# EAGLE schematic GrblMainboard - v3.0 (EAGLE 6.3)
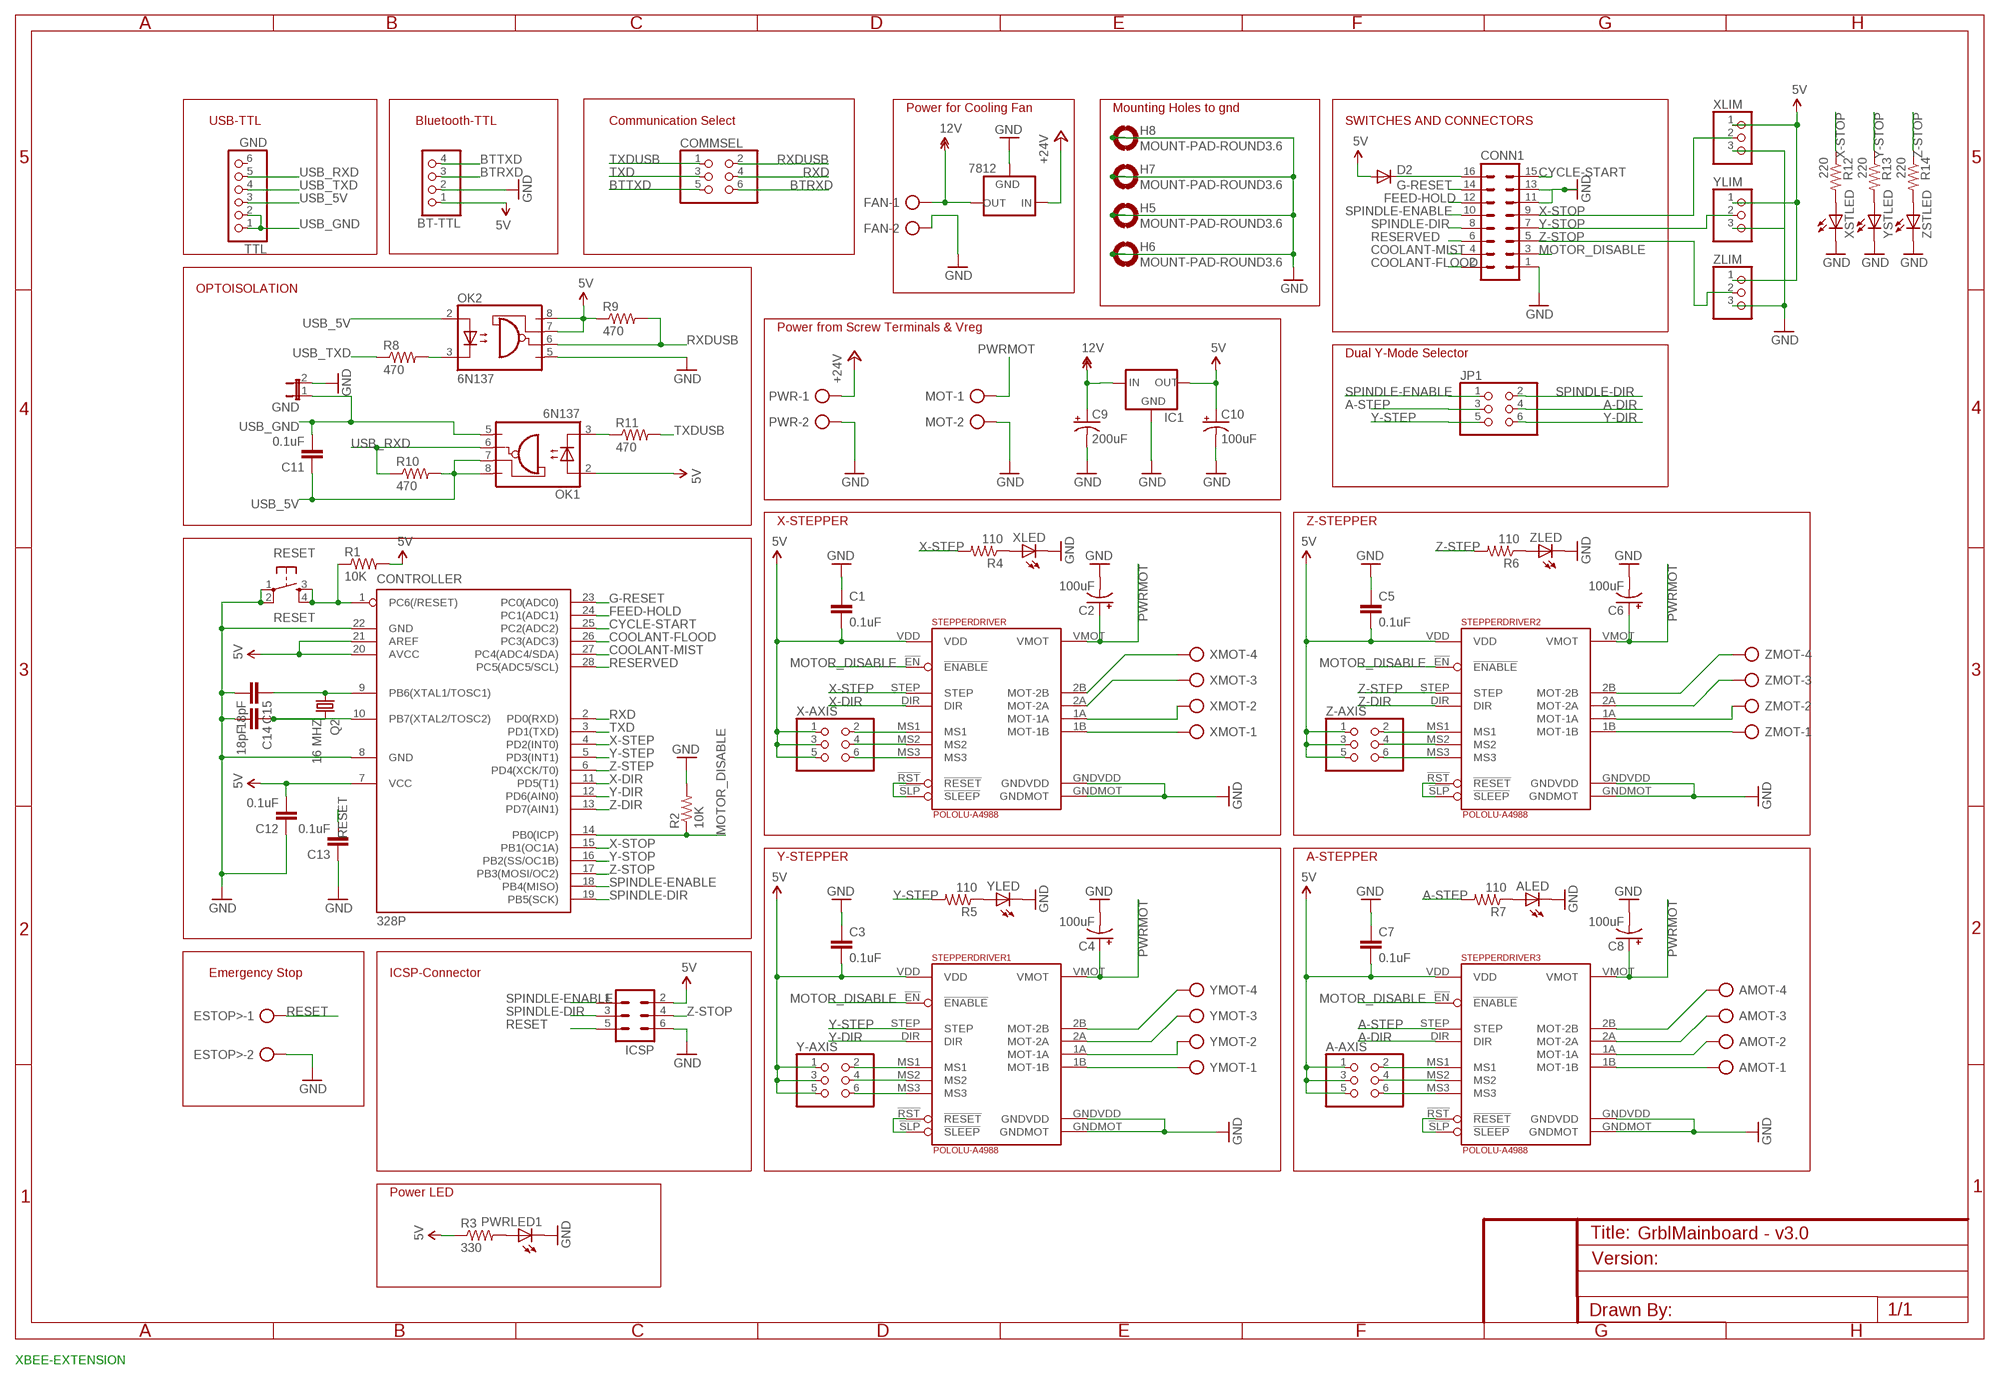
[diagram p0: schematic, sheet 1]

## Parts
328P  CONTROLLER  MEGA8-P  [DIL28-3]
7812  V_REG_78XXSINK  [TO220-IGO]
A-AXIS  PINHD-2X3  [2X03]
ALED  LED3MM  [LED3MM]
AMOT  AK500/4  [AK500/4]
BT-TTL  PINHD-1X4  [1X04]
C1  0.1uF  C-EU025-025X050  [C025-025X050]
C2  100uF  CPOL-USE3.5-8  [E3,5-8]
C3  0.1uF  C-EU025-025X050  [C025-025X050]
C4  100uF  CPOL-USE3.5-8  [E3,5-8]
C5  0.1uF  C-EU025-025X050  [C025-025X050]
C6  100uF  CPOL-USE3.5-8  [E3,5-8]
C7  0.1uF  C-EU025-025X050  [C025-025X050]
C8  100uF  CPOL-USE3.5-8  [E3,5-8]
C9  200uF  CPOL-USE2.5-6  [E2,5-6]
C10  100uF  CPOL-USE2.5-6  [E2,5-6]
C11  0.1uF  C-EU025-025X050  [C025-025X050]
C12  0.1uF  C-EU025-025X050  [C025-025X050]
C13  0.1uF  C-EU025-025X050  [C025-025X050]
C14  18pF  C-EU025-025X050  [C025-025X050]
C15  18pF  C-EU025-025X050  [C025-025X050]
COMMSEL  PINHD-2X3  [2X03]
CONN1  ML16  [ML16]
D2  DIODEPTH  [DIODE-1N4001]
ESTOP>  AK500/2  [AK500/2]
FAN  AK500/2  [AK500/2]
GND  JP1E  [JP1]
H5  MOUNT-PAD-ROUND3.6  [3,6-PAD]
H6  MOUNT-PAD-ROUND3.6  [3,6-PAD]
H7  MOUNT-PAD-ROUND3.6  [3,6-PAD]
H8  MOUNT-PAD-ROUND3.6  [3,6-PAD]
IC1  V_REG_78XXSINK  [TO220-IGO]
ICSP  ML6  [ML6]
JP1  PINHD-2X3  [2X03]
MOT  AK500/2  [AK500/2]
OK1  6N137  [DIL08]
OK2  6N137  [DIL08]
PWR  AK500/2  [AK500/2]
PWRLED1  LED3MM  [LED3MM]
Q2  16 MHZ  CRYSTALHC49S  [HC49/S]
R1  10K  RESISTORAXIAL-0.3  [AXIAL-0.3]
R2  10K  RESISTORAXIAL-0.3  [AXIAL-0.3]
R3  330  RESISTORPTH-1/6W  [1/6W-RES]
R4  110  RESISTORAXIAL-0.3  [AXIAL-0.3]
R5  110  RESISTORAXIAL-0.3  [AXIAL-0.3]
R6  110  RESISTORAXIAL-0.3  [AXIAL-0.3]
R7  110  RESISTORAXIAL-0.3  [AXIAL-0.3]
R8  470  RESISTORAXIAL-0.3  [AXIAL-0.3]
R9  470  RESISTORAXIAL-0.3  [AXIAL-0.3]
R10  470  RESISTORAXIAL-0.3  [AXIAL-0.3]
R11  470  RESISTORAXIAL-0.3  [AXIAL-0.3]
R12  220  RESISTORAXIAL-0.3  [AXIAL-0.3]
R13  220  RESISTORAXIAL-0.3  [AXIAL-0.3]
R14  220  RESISTORAXIAL-0.3  [AXIAL-0.3]
RESET  RESET  TAC_SWITCHPTH  [TACTILE-PTH]
STEPPERDRIVER  POLOLU-A4988  POLOLU-ALLEGRO  [POLOLU-ALLEGRO-PTH]
STEPPERDRIVER1  POLOLU-A4988  POLOLU-ALLEGRO  [POLOLU-ALLEGRO-PTH]
STEPPERDRIVER2  POLOLU-A4988  POLOLU-ALLEGRO  [POLOLU-ALLEGRO-PTH]
STEPPERDRIVER3  POLOLU-A4988  POLOLU-ALLEGRO  [POLOLU-ALLEGRO-PTH]
TTL  GND  PINHD-1X6  [1X06]
X-AXIS  PINHD-2X3  [2X03]
XLED  LED3MM  [LED3MM]
XLIM  PINHD-1X3  [1X03]
XMOT  AK500/4  [AK500/4]
XSTLED  LED3MM  [LED3MM]
Y-AXIS  PINHD-2X3  [2X03]
YLED  LED3MM  [LED3MM]
YLIM  PINHD-1X3  [1X03]
YMOT  AK500/4  [AK500/4]
YSTLED  LED3MM  [LED3MM]
Z-AXIS  PINHD-2X3  [2X03]
ZLED  LED3MM  [LED3MM]
ZLIM  PINHD-1X3  [1X03]
ZMOT  AK500/4  [AK500/4]
ZSTLED  LED3MM  [LED3MM]

## Nets
5V: 328P.7(VCC) 328P.20(AVCC) 328P.21(AREF) A-AXIS.1 A-AXIS.3 A-AXIS.5 BT-TTL.1 C1.2 C3.2 C5.2 C7.2 C10.+ C12.2 D2.A IC1.OUT ICSP.2 OK1.2(A) OK2.7(VE) OK2.8(VCC) R1.P$2 R3.1 R9.P$1 STEPPERDRIVER1.VDD STEPPERDRIVER2.VDD STEPPERDRIVER3.VDD STEPPERDRIVER.VDD X-AXIS.1 X-AXIS.3 X-AXIS.5 XLIM.1 Y-AXIS.1 Y-AXIS.3 Y-AXIS.5 YLIM.1 Z-AXIS.1 Z-AXIS.3 Z-AXIS.5 ZLIM.1
12V [power]: 7812.OUT C9.+ FAN.1 IC1.IN
+24V [power]: 7812.IN PWR.1
A-DIR: JP1.4 STEPPERDRIVER3.DIR
A-STEP: JP1.3 R7.P$2 STEPPERDRIVER3.STEP
BTRXD: BT-TTL.3 COMMSEL.6
BTTXD: BT-TTL.4 COMMSEL.5
COOLANT-FLOOD: 328P.26(PC3(ADC3)) CONN1.2
COOLANT-MIST: 328P.27(PC4(ADC4/SDA)) CONN1.4
CYCLE-START: 328P.25(PC2(ADC2)) CONN1.15
FEED-HOLD: 328P.24(PC1(ADC1)) CONN1.12
G-RESET: 328P.23(PC0(ADC0)) CONN1.14
GND [power]: 328P.8(GND) 328P.22(GND) 7812.GND ALED.K(C) BT-TTL.2 C1.1 C2.- C3.1 C4.- C5.1 C6.- C7.1 C8.- C9.- C10.- C12.1 C13.1 C14.2 C15.2 CONN1.1 CONN1.11 CONN1.13 ESTOP>.2 FAN.2 GND.2 H5.B3,6(MOUNT) H6.B3,6(MOUNT) H7.B3,6(MOUNT) H8.B3,6(MOUNT) IC1.GND ICSP.6 MOT.2 OK2.5(GND) PWR.2 PWRLED1.K(C) R2.P$2 RESET.1 RESET.2 STEPPERDRIVER1.GNDMOT STEPPERDRIVER1.GNDVDD STEPPERDRIVER2.GNDMOT STEPPERDRIVER2.GNDVDD STEPPERDRIVER3.GNDMOT STEPPERDRIVER3.GNDVDD STEPPERDRIVER.GNDMOT STEPPERDRIVER.GNDVDD XLED.K(C) XLIM.3 XSTLED.K(C) YLED.K(C) YLIM.3 YSTLED.K(C) ZLED.K(C) ZLIM.3 ZSTLED.K(C)
MOTOR_DISABLE: 328P.14(PB0(ICP)) CONN1.3 R2.P$1 STEPPERDRIVER1.!EN(!ENABLE) STEPPERDRIVER2.!EN(!ENABLE) STEPPERDRIVER3.!EN(!ENABLE) STEPPERDRIVER.!EN(!ENABLE)
N$1 [power]: STEPPERDRIVER.1B(MOT-1B) XMOT.1
N$2 [power]: STEPPERDRIVER.1A(MOT-1A) XMOT.2
N$3 [power]: STEPPERDRIVER.2A(MOT-2A) XMOT.3
N$4 [power]: STEPPERDRIVER.2B(MOT-2B) XMOT.4
N$5: STEPPERDRIVER.!RST(!RESET) STEPPERDRIVER.!SLP(!SLEEP)
N$6: STEPPERDRIVER.MS1 X-AXIS.2
N$7: STEPPERDRIVER.MS2 X-AXIS.4
N$8: STEPPERDRIVER.MS3 X-AXIS.6
N$9 [power]: STEPPERDRIVER1.1B(MOT-1B) YMOT.1
N$10 [power]: STEPPERDRIVER1.1A(MOT-1A) YMOT.2
N$11 [power]: STEPPERDRIVER1.2A(MOT-2A) YMOT.3
N$12 [power]: STEPPERDRIVER1.2B(MOT-2B) YMOT.4
N$13: STEPPERDRIVER1.!RST(!RESET) STEPPERDRIVER1.!SLP(!SLEEP)
N$14: STEPPERDRIVER1.MS1 Y-AXIS.2
N$15: STEPPERDRIVER1.MS2 Y-AXIS.4
N$16: STEPPERDRIVER1.MS3 Y-AXIS.6
N$17 [power]: STEPPERDRIVER2.2B(MOT-2B) ZMOT.4
N$18 [power]: STEPPERDRIVER2.2A(MOT-2A) ZMOT.3
N$19 [power]: STEPPERDRIVER2.1A(MOT-1A) ZMOT.2
N$20 [power]: STEPPERDRIVER2.1B(MOT-1B) ZMOT.1
N$21: STEPPERDRIVER2.!RST(!RESET) STEPPERDRIVER2.!SLP(!SLEEP)
N$22: STEPPERDRIVER2.MS1 Z-AXIS.2
N$23: STEPPERDRIVER2.MS2 Z-AXIS.4
N$24: STEPPERDRIVER2.MS3 Z-AXIS.6
N$25 [power]: AMOT.1 STEPPERDRIVER3.1B(MOT-1B)
N$26 [power]: AMOT.2 STEPPERDRIVER3.1A(MOT-1A)
N$27 [power]: AMOT.3 STEPPERDRIVER3.2A(MOT-2A)
N$28 [power]: AMOT.4 STEPPERDRIVER3.2B(MOT-2B)
N$29: STEPPERDRIVER3.!RST(!RESET) STEPPERDRIVER3.!SLP(!SLEEP)
N$30: A-AXIS.2 STEPPERDRIVER3.MS1
N$31: A-AXIS.4 STEPPERDRIVER3.MS2
N$32: A-AXIS.6 STEPPERDRIVER3.MS3
N$33: 328P.9(PB6(XTAL1/TOSC1)) C15.1 Q2.1
N$34: 328P.10(PB7(XTAL2/TOSC2)) C14.1 Q2.2
N$35: OK2.3(C) R8.P$2
N$36: OK1.3(C) R11.P$1
N$37: R12.P$2 XSTLED.A
N$38: R4.P$1 XLED.A
N$39: R5.P$1 YLED.A
N$40: R6.P$1 ZLED.A
N$41: ALED.A R7.P$1
N$42: R13.P$2 YSTLED.A
N$43: PWRLED1.A R3.2
N$44: R14.P$2 ZSTLED.A
N$45: CONN1.16 D2.C
PWRMOT [power]: C2.+ C4.+ C6.+ C8.+ MOT.1 STEPPERDRIVER1.VMOT STEPPERDRIVER2.VMOT STEPPERDRIVER3.VMOT STEPPERDRIVER.VMOT
RESERVED: 328P.28(PC5(ADC5/SCL)) CONN1.6
RESET: 328P.1(PC6(/RESET)) C13.2 ESTOP>.1 ICSP.5 R1.P$1 RESET.3 RESET.4
RXD: 328P.2(PD0(RXD)) COMMSEL.4
RXDUSB: COMMSEL.2 OK2.6(VO) R9.P$2
SPINDLE-DIR: 328P.19(PB5(SCK)) CONN1.8 ICSP.3 JP1.2
SPINDLE-ENABLE: 328P.18(PB4(MISO)) CONN1.10 ICSP.1 JP1.1
TXD: 328P.3(PD1(TXD)) COMMSEL.3
TXDUSB: COMMSEL.1 R11.P$2
USB_5V: C11.1 OK1.7(VE) OK1.8(VCC) OK2.2(A) R10.P$2 TTL.3
USB_GND [power]: C11.2 GND.1 OK1.5(GND) TTL.1 TTL.2
USB_RXD: OK1.6(VO) R10.P$1 TTL.5
USB_TXD: R8.P$1 TTL.4
X-DIR: 328P.11(PD5(T1)) STEPPERDRIVER.DIR
X-STEP: 328P.4(PD2(INT0)) R4.P$2 STEPPERDRIVER.STEP
X-STOP: 328P.15(PB1(OC1A)) CONN1.9 R12.P$1 XLIM.2
Y-DIR: 328P.12(PD6(AIN0)) JP1.6 STEPPERDRIVER1.DIR
Y-STEP: 328P.5(PD3(INT1)) JP1.5 R5.P$2 STEPPERDRIVER1.STEP
Y-STOP: 328P.16(PB2(SS/OC1B)) CONN1.7 R13.P$1 YLIM.2
Z-DIR: 328P.13(PD7(AIN1)) STEPPERDRIVER2.DIR
Z-STEP: 328P.6(PD4(XCK/T0)) R6.P$2 STEPPERDRIVER2.STEP
Z-STOP: 328P.17(PB3(MOSI/OC2)) CONN1.5 ICSP.4 R14.P$1 ZLIM.2
Unconnected: TTL.6

## Notes on the sheet
- Power for Cooling Fan | Mounting Holes to gnd
- USB-TTL | Bluetooth-TTL | Communication Select | SWITCHES AND CONNECTORS
- OPTOISOLATION
- Power from Screw Terminals & Vreg
- Dual Y-Mode Selector
- X-STEPPER | Z-STEPPER
- Y-STEPPER | A-STEPPER
- Emergency Stop | ICSP-Connector
- Power LED
- XBEE-EXTENSION

## Library data of the parts
328P = Bibsatmel:MEGA8-P: MICROCONTROLLER 8 Kbytes FLASH, 1 kbytes SRAM, 512 bytes EEPROM, USART, 4-channel 10 bit ADC, 2-channel 8 bit ADC Pin compatible with Atmega48, ATMega88, ATMega168 Source: avr.lbr; OC_FARNELL: unknown; OC_NEWARK: unknown
7812 IC1 = SparkFun-PowerIC:V_REG_78XX: Voltage Regulator Standard 7805 5V regulator. IGO (Input Ground Output). Spark Fun Electronics SKU : COM-00107
A-AXIS COMMSEL JP1 X-AXIS Y-AXIS Z-AXIS = pinhead:PINHD-2X3: PIN HEADER
ALED PWRLED1 XLED XSTLED YLED YSTLED ZLED ZSTLED = led:LED: LED OSRAM: - CHIPLED LG R971, LG N971, LY N971, LG Q971, LY Q971, LO R971, LY R971 LH N974, LH R974 LS Q976, LO Q976, LY Q976 LO Q996 - Hyper CHIPLED LW Q18S LB Q993, LB Q99A, LB R99A - SideLED LS A670, LO A670, LY A670, LG A670, LP A670 LB A673, LV A673, LT A673, LW A673 LH A674 LY A675 LS A676, LA A676, LO A676, LY A676, LW A676 LS A679, LY A679, LG A679 - Hyper Micro SIDELED® LS Y876, LA Y876, LO Y876, LY Y876 LT Y87S - SmartLED LW L88C, LW L88S LB L89C, LB L89S, LG L890 LS L89K, LO L89K, LY L89K LS L896, LA L896, LO L896, LY L896 - TOPLED LS T670, LO T670, LY T670, LG T670, LP T670 LSG T670, LSP T670, LSY T670, LOP T670, LYG T670 LG T671, LOG T671, LSG T671 LB T673, LV T673, LT T673, LW T673 LH T674 LS T676, LA T676, LO T676, LY T676, LB T676, LH T676, LSB T676, LW T676 LB T67C, LV T67C, LT T67C, LS T67K, LO T67K, LY T67K, LW E67C LS E67B, LA E67B, LO E67B, LY E67B, LB E67C, LV E67C, LT E67C LW T67C LS T679, LY T679, LG T679 LS T770, LO T770, LY T770, LG T770, LP T770 LB T773, LV T773, LT T773, LW T773 LH T774 LS E675, LA E675, LY E675, LS T675 LS T776, LA T776, LO T776, LY T776, LB T776 LHGB T686 LT T68C, LB T68C - Hyper Mini TOPLED® LB M676 - Mini TOPLED Santana® LG M470 LS M47K, LO M47K, LY M47K Source: http://www.osram.convergy.de LUXEON: - LUMILED® LXK2-PW12-R00, LXK2-PW12-S00, LXK2-PW14-U00, LXK2-PW14-V00 LXK2-PM12-R00, LXK2-PM12-S00, LXK2-PM14-U00 LXK2-PE12-Q00, LXK2-PE12-R00, LXK2-PE12-S00, LXK2-PE14-T00, LXK2-PE14-U00 LXK2-PB12-K00, LXK2-PB12-L00, LXK2-PB12-M00, LXK2-PB14-N00, LXK2-PB14-P00, LXK2-PB14-Q00 LXK2-PR12-L00, LXK2-PR12-M00, LXK2-PR14-Q00, LXK2-PR14-R00 LXK2-PD12-Q00, LXK2-PD12-R00, LXK2-PD12-S00 LXK2-PH12-R00, LXK2-PH12-S00 LXK2-PL12-P00, LXK2-PL12-Q00, LXK2-PL12-R00 Source: www.luxeon.com KINGBRIGHT: KA-3528ASYC Source: www.kingbright.com
AMOT XMOT YMOT ZMOT = con-ptr500:AK500/4: CONNECTOR; OC_FARNELL: unknown; OC_NEWARK: unknown
BT-TTL = pinhead:PINHD-1X4: PIN HEADER
C1 C3 C5 C7 C11-C15 = resistor:C-EU: CAPACITOR, European symbol
C2 C4 C6 C8-C10 = resistor:CPOL-US: POLARIZED CAPACITOR, American symbol
CONN1 = con-ml:ML16: HARTING; OC_FARNELL: unknown; OC_NEWARK: unknown
D2 = SparkFun-DiscreteSemi:DIODE: Diode These are standard reverse protection diodes and small signal diodes. SMA package can handle up to about 1A. SOD-323 can handle about 200mA. What the SOD-323 package when ordering, there are some mfgs out there that are 5-pin packages.
ESTOP> FAN MOT PWR = con-ptr500:AK500/2: CONNECTOR; OC_FARNELL: unknown; OC_NEWARK: unknown
GND = jumper:JP1E: JUMPER
H5-H8 = holes:MOUNT-PAD-ROUND: MOUNTING PAD, round
ICSP = con-ml:ML6: HARTING; OC_FARNELL: unknown; OC_NEWARK: unknown
OK1 OK2 = optocoupler:6N137: MOTOROLA OPTO COUPLER; MPN: 6N137; OC_FARNELL: 1328376; OC_NEWARK: 52M1895
Q2 = crystal:CRYSTAL: CRYSTAL; OC_FARNELL: 1667008; OC_NEWARK: unknown
R1-R14 = SparkFun-Resistors:RESISTOR: Resistor Basic schematic elements and footprints for 0603, 1206, and PTH resistors.
RESET = SparkFun:TAC_SWITCH: Momentary Switch Button commonly used for reset or general input. Spark Fun Electronics SKU : COM-00097
STEPPERDRIVER STEPPERDRIVER1-STEPPERDRIVER3 = pololu-allegro:POLOLU-ALLEGRO
TTL = pinhead:PINHD-1X6: PIN HEADER
XLIM YLIM ZLIM = pinhead:PINHD-1X3: PIN HEADER

## Net classes
0 default: width 0.203 mm, clearance 0.203 mm
1 power: width 1.016 mm, clearance 0.305 mm